# EAGLE design Wii Board (EAGLE 6.6.0)
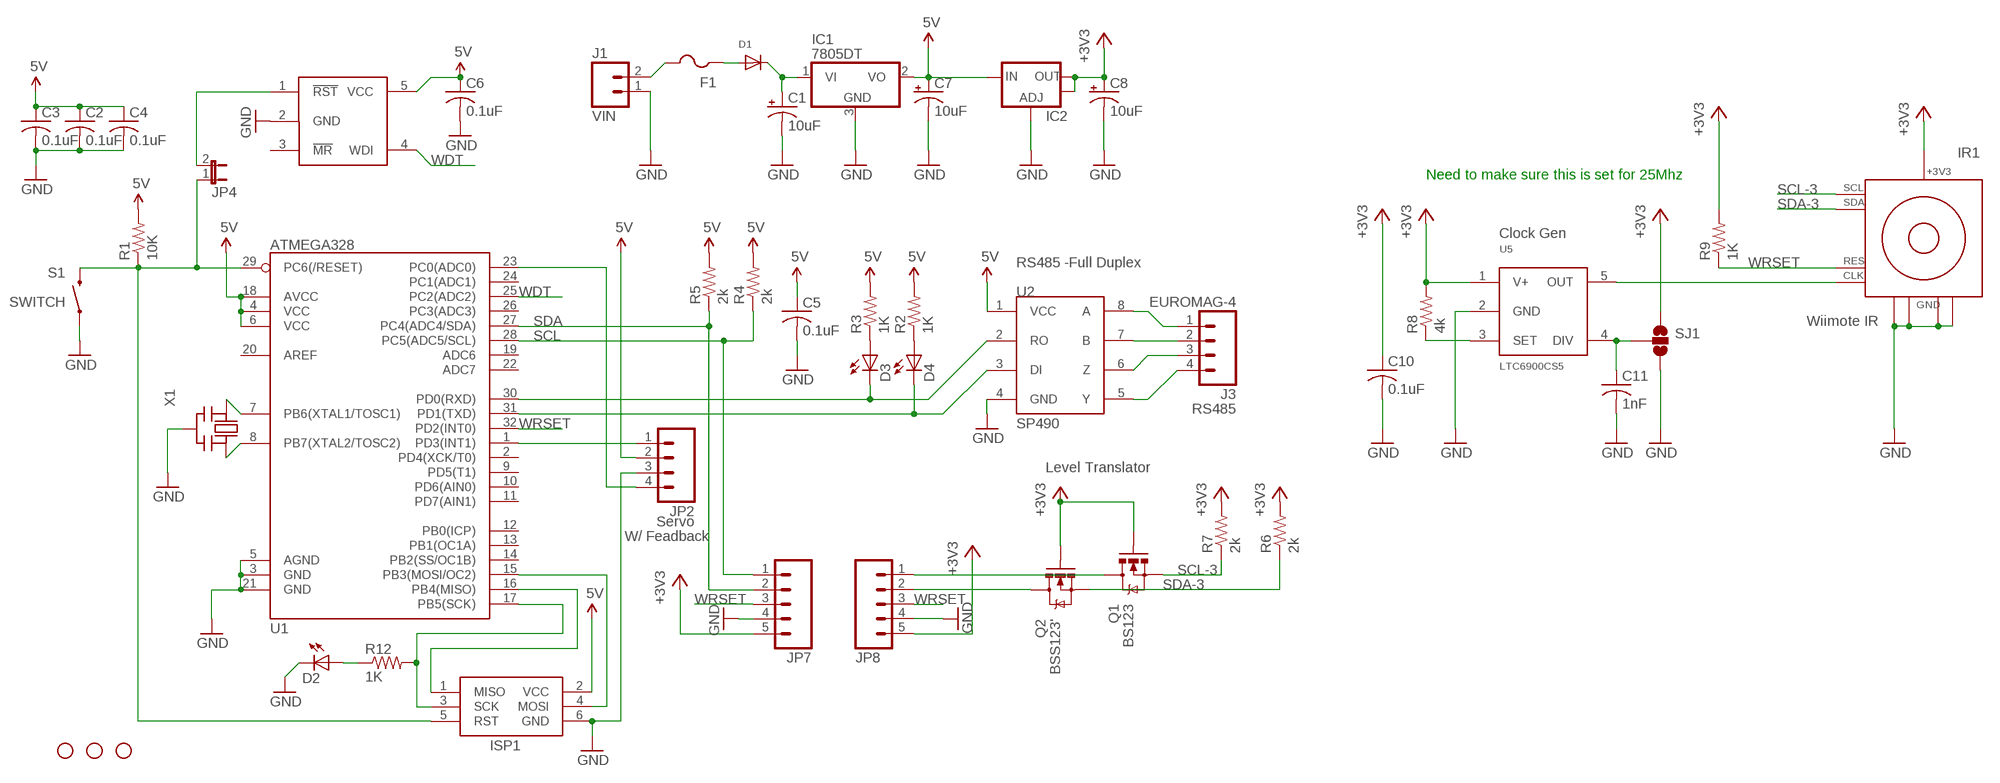
[diagram p0: schematic, sheet 1]

## Parts
C1  10uF  CPOL-USCT6032  [CT6032]
C2  0.1uF  C-USC0805  [C0805]
C3  0.1uF  C-USC0805  [C0805]
C4  0.1uF  C-USC0805  [C0805]
C5  0.1uF  C-USC0805  [C0805]
C6  0.1uF  C-USC0805  [C0805]
C7  10uF  CPOL-USCT3216  [CT3216]
C8  10uF  CPOL-USCT3528  [CT3528]
C10  0.1uF  C-USC0805  [C0805]
C11  1nF  C-USC0805  [C0805]
D1  DIODESMA  [SMADIODE]
D2  LEDCHIPLED_0805  [CHIPLED_0805]
D3  LEDCHIPLED_0805  [CHIPLED_0805]
D4  LEDCHIPLED_0805  [CHIPLED_0805]
F1  PTCFUSE-1206  [R1206]
IC1  7805DT  [TO252]
IC2  V_REG_LM1117SOT223  [SOT223]
IR1  Wiimote IR  WII_IR_SENSOR  [WII_IR_SENSOR]
ISP1  AVRISP-6  [AVRISP]
J1  VIN  EUROMAG-290DEG  [M2]
J3  EUROMAG-4  [M4]
JP1  STAND-OFF  [STAND-OFF]
JP2  M04LOCK  [1X04_LOCK]
JP3  STAND-OFF  [STAND-OFF]
JP4  JUMPER-2SMD-NO  [SJ_2S-NO]
JP5  STAND-OFF  [STAND-OFF]
JP7  M05LOCK_LONGPADS  [1X05_LOCK_LONGPADS]
JP8  M05LOCK_LONGPADS  [1X05_LOCK_LONGPADS]
Q1  BS123  MOSFET-NCHANNELBSS123LT1G  [SOT23]
Q2  BSS123'  MOSFET-NCHANNELBSS123LT1G  [SOT23]
R1  10K  R-US_M0805  [M0805]
R2  1K  R-US_M0805  [M0805]
R3  1K  R-US_M0805  [M0805]
R4  2k  R-US_M0805  [M0805]
R5  2k  R-US_M0805  [M0805]
R6  2k  R-US_M0805  [M0805]
R7  2k  R-US_M0805  [M0805]
R8  4k  R-US_M0805  [M0805]
R9  1K  R-US_M0805  [M0805]
R12  1K  R-US_M0805  [M0805]
S1  SWITCH  SWITCH-MOMENTARY-2PTH  [TACTILE-PTH]
SJ1  SOLDERJUMPER_2WAYS  [SJ_3]
U1  ATMEGA328  ATMEGA168  [TQFP32-08]
U2  SP490  ISL83077  [SO08]
U3  MAX823  [SOT23-5L]
U5  LTC6900CS5  [TSOT-23-5]
X1  CERMOSCILL-AWCSR  [AWCSR]

## Nets
5V: C2.1 C3.1 C4.1 C5.1 C6.1 C7.+ IC1.2(VO) IC2.3(IN) ISP1.2(VCC) JP2.2 R1.2 R2.2 R3.2 R4.2 R5.2 U1.4(VCC) U1.6(VCC) U1.18(AVCC) U2.1(VCC) U3.5(VCC)
+3V3: C8.+ C10.1 IC2.2(OUT) IC2.4(OUT) IR1.1_+3V3(+3V3) JP7.5 JP8.5 Q1.1(G) Q2.1(G) R6.2 R7.2 R8.2 R9.2 SJ1.1 U5.1(V+)
C5: ISP1.4(MOSI) U1.15(PB3(MOSI/OC2))
GND: C1.- C2.2 C3.2 C4.2 C5.2 C6.2 C7.- C8.- C10.2 C11.2 D2.C IC1.3(GND) IC2.1(ADJ) IR1.2_GND@1(GND) IR1.3_GND@2(GND) IR1.GND@3(GND) IR1.GND@4(GND) ISP1.6(GND) J1.1 JP2.3 JP7.4 JP8.4 S1.1 SJ1.3 U1.3(GND) U1.5(AGND) U1.21(GND) U2.4(GND) U3.2(GND) U5.2(GND) X1.2(GND)
N$1: D3.C U1.30(PD0(RXD)) U2.2(RO)
N$2: F1.2 J1.2
N$3: D4.C U1.31(PD1(TXD)) U2.3(DI)
N$4: ISP1.5(RST) JP4.1 R1.1 S1.3 U1.29(PC6(/RESET))
N$5: U1.8(PB7(XTAL2/TOSC2)) X1.3(OUT)
N$6: J3.1 U2.8(A)
N$7: ISP1.1(MISO) U1.16(PB4(MISO))
N$8: D1.A F1.1
N$9: U1.7(PB6(XTAL1/TOSC1)) X1.1(IN)
N$10: D2.A R12.1
N$11: J3.2 U2.7(B)
N$12: J3.3 U2.6(Z)
N$13: C1.+ D1.C IC1.1(VI)
N$14: D4.A R2.1
N$15: J3.4 U2.5(Y)
N$16: D3.A R3.1
N$17: R8.1 U5.3(SET)
N$18: JP2.1 U1.1(PD3(INT1))
N$19: C11.1 SJ1.2 U5.4(DIV)
N$20: IR1.7_CLK(CLK) U5.5(OUT)
N$21: JP4.2 U3.1(!RST)
N$22: JP2.4 U1.23(PC0(ADC0))
N$23: JP8.1 Q1.3(D)
N$24: JP8.2 Q2.3(D)
SCL: JP7.1 R4.1 U1.28(PC5(ADC5/SCL))
SCL-3: IR1.5_SCL(SCL) Q1.2(S) R7.1
SCLK: ISP1.3(SCK) R12.2 U1.17(PB5(SCK))
SDA: JP7.2 R5.1 U1.27(PC4(ADC4/SDA))
SDA-3: IR1.6_SDA(SDA) Q2.2(S) R6.1
WDT: U1.25(PC2(ADC2)) U3.4(WDI)
WRSET: IR1.8_RESET(RES) JP7.3 JP8.3 R9.1 U1.32(PD2(INT0))
Unconnected: U1.2(PD4(XCK/T0)) U1.9(PD5(T1)) U1.10(PD6(AIN0)) U1.11(PD7(AIN1)) U1.12(PB0(ICP)) U1.13(PB1(OC1A)) U1.14(PB2(SS/OC1B)) U1.19(ADC6) U1.20(AREF) U1.22(ADC7) U1.24(PC1(ADC1)) U1.26(PC3(ADC3)) U3.3(!MR)

## Notes on the sheet
- Need to make sure this is set for 25Mhz
- Clock Gen
- RS485 -Full Duplex
- RS485
- Level Translator
- Servo
- W/ Feadback

## Library data of the parts
C1 C7 C8 = adafruit:CPOL-US: POLARIZED CAPACITOR, American symbol
C2-C6 C10 C11 = adafruit:C-US: CAPACITOR, American symbol
D1 = adafruit:DIODE: Diode SMADIODE - SMA Surface Mount Package 20V 1A Schottky Diode Digikey: 641-1014-6-ND DO-1N4148 - Through Hole Small Current Diode SOD-123 20V 1 A (.5mV Vf) Schottky Diode - Digikey: MBRX120TPMSCT-ND SOD-323 10V 570mA (.38mV Vf, 3ns) Schottky Diode - Digikey: ZLLS410CT-ND SOD-523 30V 30mA Schottky Diode (RB751S-40TE61) - Digikey: RB751S-40TE61CT-ND SOT23-R/W - SOT23 Package (R = Solder Paste/Reflow Ovens, W = Hand-Soldering) BAT54Film 40V 300mA - Digikey: 497-7162-1-ND
D2-D4 = adafruit:LED: LED OSRAM: - CHIPLED LG R971, LG N971, LY N971, LG Q971, LY Q971, LO R971, LY R971 LH N974, LH R974 LS Q976, LO Q976, LY Q976 LO Q996 - Hyper CHIPLED LW Q18S LB Q993, LB Q99A, LB R99A - SideLED LS A670, LO A670, LY A670, LG A670, LP A670 LB A673, LV A673, LT A673, LW A673 LH A674 LY A675 LS A676, LA A676, LO A676, LY A676, LW A676 LS A679, LY A679, LG A679 - Hyper Micro SIDELED® LS Y876, LA Y876, LO Y876, LY Y876 LT Y87S - SmartLED LW L88C, LW L88S LB L89C, LB L89S, LG L890 LS L89K, LO L89K, LY L89K LS L896, LA L896, LO L896, LY L896 - TOPLED LS T670, LO T670, LY T670, LG T670, LP T670 LSG T670, LSP T670, LSY T670, LOP T670, LYG T670 LG T671, LOG T671, LSG T671 LB T673, LV T673, LT T673, LW T673 LH T674 LS T676, LA T676, LO T676, LY T676, LB T676, LH T676, LSB T676, LW T676 LB T67C, LV T67C, LT T67C, LS T67K, LO T67K, LY T67K, LW E67C LS E67B, LA E67B, LO E67B, LY E67B, LB E67C, LV E67C, LT E67C LW T67C LS T679, LY T679, LG T679 LS T770, LO T770, LY T770, LG T770, LP T770 LB T773, LV T773, LT T773, LW T773 LH T774 LS E675, LA E675, LY E675, LS T675 LS T776, LA T776, LO T776, LY T776, LB T776 LHGB T686 LT T68C, LB T68C - Hyper Mini TOPLED® LB M676 - Mini TOPLED Santana® LG M470 LS M47K, LO M47K, LY M47K Source: http://www.osram.convergy.de/
F1 = adafruit:PTCFUSE: PTC fuses, resettable thermistors
IC1 = adafruit:78*: Positive VOLTAGE REGULATOR Added bigger pads to the TO-92 package
IC2 = SparkFun-PowerIC:V_REG_LM1117: Voltage Regulator LM1117 Standard adjustable voltage regulator but in SMD form. Spark Fun Electronics SKU : COM-00595
IR1 = OWN:WII_IR_SENSOR
ISP1 = adafruit:AVRISP: AVR ISP HEADER Standard 6 pin header for AVR programming
J1 = NASA_LIB:EUROMAG-2
J3 = NASA_LIB:EUROMAG-4
JP1 JP3 JP5 = SparkFun:STAND-OFF: Stand Off This is the mechanical footprint for a #4 phillips button head screw. Use the keepout ring to avoid running the screw head into surrounding components. SKU : PRT-00447
JP2 = SparkFun-Connectors:M04: Header 4 Standard 4-pin 0.1" header. Use with straight break away headers (SKU : PRT-00116), right angle break away headers (PRT-00553), swiss pins (PRT-00743), machine pins (PRT-00117), and female headers (PRT-00115). Molex polarized connector foot print use with SKU : PRT-08231 with associated crimp pins and housings. 1MM SMD Version SKU: PRT-10208
JP4 = SparkFun-Passives:JUMPER-2: Jumper Basic 0.1" spaced jumper. Use with breakaway headers.
JP7 JP8 = SparkFun-Connectors:M05: Header 5 Standard 5-pin 0.1" header. Use with straight break away headers (SKU : PRT-00116), right angle break away headers (PRT-00553), swiss pins (PRT-00743), machine pins (PRT-00117), and female headers (PRT-00115). Molex polarized connector foot print use with SKU : PRT-08230 with associated crimp pins and housings.
Q1 Q2 = SparkFun-DiscreteSemi:MOSFET-NCHANNEL: Common NMOSFET Parts MFG P/N Store ID Prod ID FDD8780 TRANS-09984 SI7820DN TRANS-11055 FDS6630A IC-08089 2N7002PW TRANS-11151 FQP30N06L COM-10213 TRANS-10060 BSS123LT1G TRANS-08345 BSS138 TRANS-00830 BS170 2N7000; PROD_ID: TRANS-08345
R1-R9 R12 = adafruit:R-US_: RESISTOR, American symbol
S1 = SparkFun:SWITCH-MOMENTARY-2
SJ1 = SparkFun-Passives:SOLDERJUMPER_2WAY: Solder Jumper 2 way solder jumper
U1 = SparkFun:ATMEGA168
U2 = NASA_LIB:ISL83077
U3 = NASA_LIB:MAX823
U5 = Gilson:LTC6900CS5
X1 = adafruit:CERMOSCILL: Ceramic oscillator with built in capacitors such as ZTT-12MHz http://www.ladyada.net/library/eagle

## Net classes
0 default: width 0.4 mm, drill 0.6 mm, clearance 0.3 mm
1 power: width 0.6 mm, drill 0.6 mm, clearance 0.3 mm

## Board
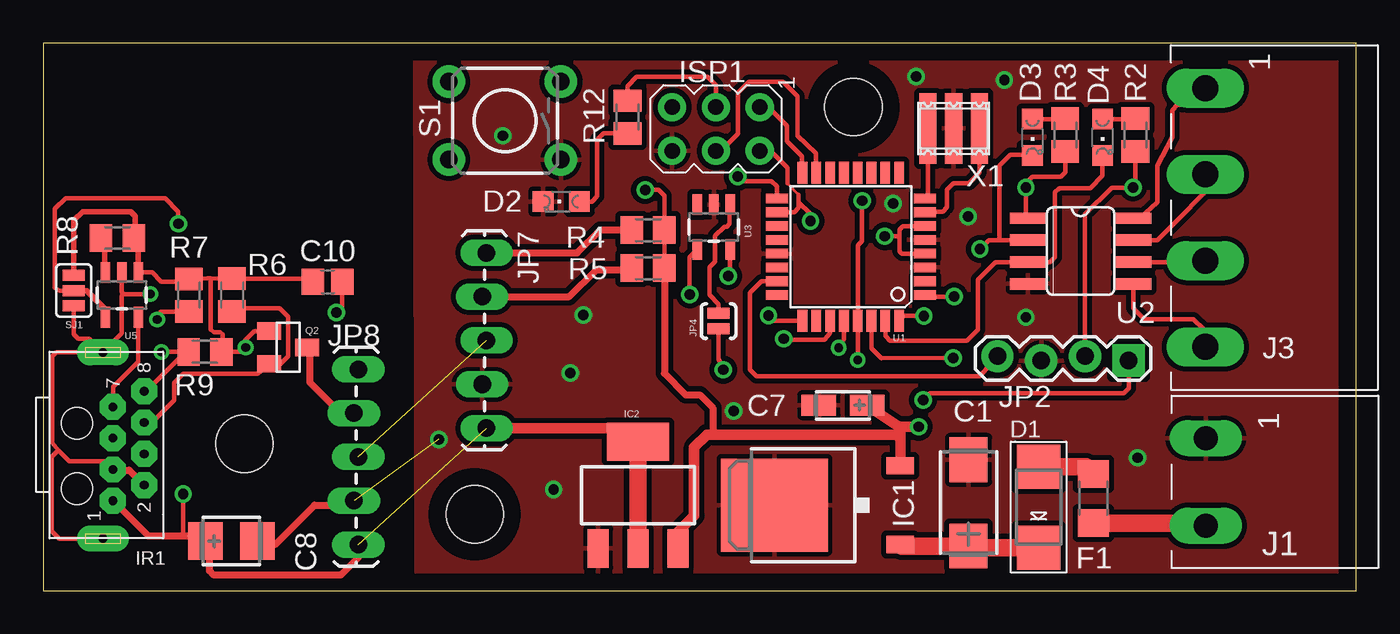
[diagram p1: board, top side]
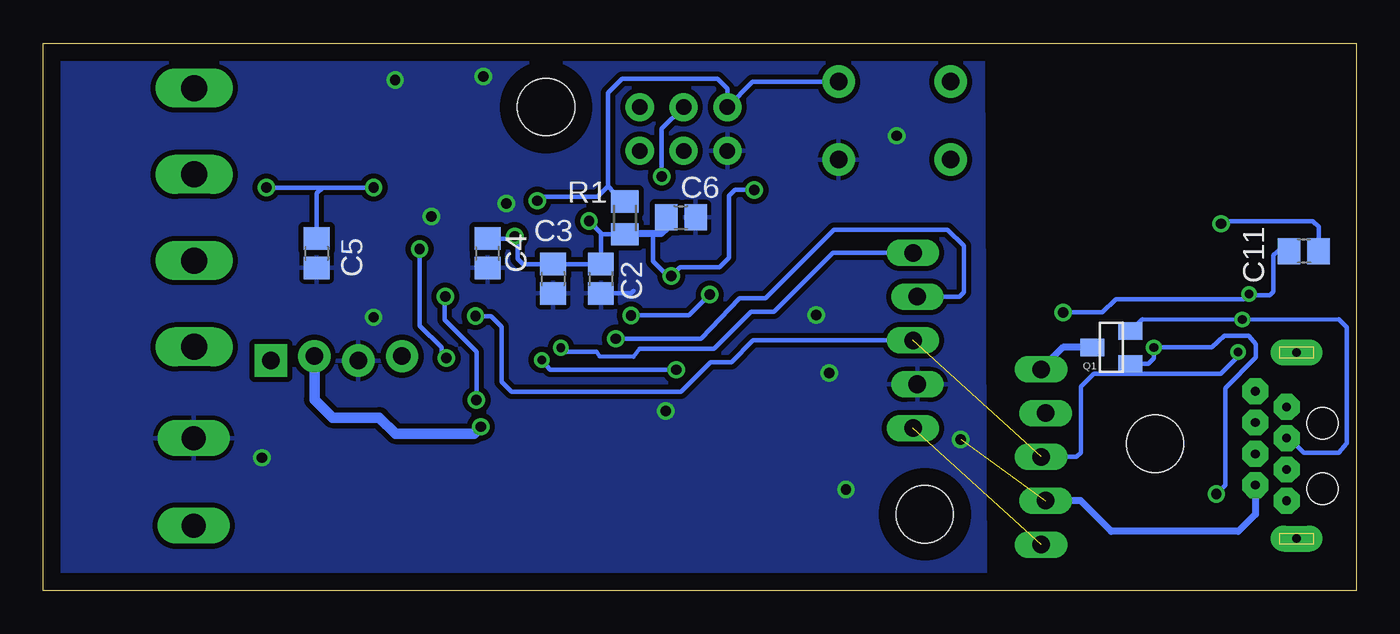
[diagram p2: board, bottom side, seen from below]

Size 76.2 x 31.75 mm. Coordinates in mm from the lower left corner, seen from the top.
Outline: 0,0 76.2,0 76.2,31.75 0,31.75 0,0
Copper layers (1*16): Top 0.035mm / dielectric 1.5mm / Bottom 0.035mm
Design rules "default *": minimum track width 7mil, minimum drill 24mil, track to track 8mil, track to pad 8mil, pad to pad 8mil, via to via 8mil, smd to smd 8mil, copper to edge 40mil, drill to drill 8mil, minimum pad ring 10mil, minimum via ring 8mil, stop-mask expansion 4mil, vias tented up to drill 0mil, thermal gap 10mil

### Footprints (pad centres in the part's own frame; a part is rotated, then mirrored left to right if it is on the bottom)
CT6032 = smd 2.6 x 2.2: + 2.5,0; - -2.5,0
C0805 = smd 1.3 x 1.5: 1 -0.85,0; 2 0.85,0
CT3216 = smd 2 x 1.2: + 1.4,0; - -1.4,0
CT3528 = smd 2 x 2.2: + 1.5,0; - -1.5,0
SMADIODE = smd 2.54 x 2.54: A 2.349,0; C -2.349,0
CHIPLED_0805 = smd 1.2 x 1.2: A 0,-1.05; C 0,1.05
R1206 = smd 1.6 x 1.803: 1 -1.422,0; 2 1.422,0
TO252 = smd 1 x 1.6: 1 -2.28,-4.8; 2 2.28,-4.8 | smd 5.4 x 6.2: 3 0,2.5
SOT223 = smd 1.219 x 2.235: 1 -2.311,-3.099; 2 0,-3.099; 3 2.311,-3.099 | smd 3.6 x 2.2: 4 0,3.099
WII_IR_SENSOR = drill 0.5 pad 1.5 octagon: 1_+3V3 0,0.014; 2_GND@1 0.907,-1.8; 3_GND@2 1.814,0.014; 4_NC 2.721,-1.8; 5_SCL 3.629,0.014; 6_SDA 4.536,-1.8; 7_CLK 5.443,0.014; 8_RESET 6.35,-1.8 | drill 0.5 pad 1.5 long: GND@3 -2.2,0.6; GND@4 8.6,0.6 | hole 1.8: 4.5,2.1; 0.7,2.1
AVRISP = drill 0.9 pad 1.626: 1 -1.27,2.54; 2 1.27,2.54; 3 -1.27,0; 4 1.27,0; 5 -1.27,-2.54; 6 1.27,-2.54
M2 = drill 1.4 long: 1 -2.54,0; 2 2.54,0
M4 = drill 1.5 long: 1 0,0; 2 5,0; 3 10,0; 4 15,0
STAND-OFF = hole 3.302: 0,0
1X04_LOCK = drill 1.016 pad 1.88 square: 1 0,0.127 | drill 1.016 pad 1.88: 2 2.54,-0.127; 3 5.08,0.127; 4 7.62,-0.127
SJ_2S-NO = smd 0.635 x 1.27: 1 -0.45,0; 2 0.45,0
1X05_LOCK_LONGPADS = drill 1.016 long: 1 0,0; 2 2.54,-0.254; 3 5.08,0; 4 7.62,-0.254; 5 10.16,0
SOT23 = smd 1 x 1.4: 1 -0.95,-1.1; 2 0.95,-1.1; 3 0,1.1
M0805 = smd 1.3 x 1.6: 1 -0.95,0; 2 0.95,0
TACTILE-PTH = drill 1.016 pad 1.88: 1 -3.251,2.261; 2 3.251,2.261; 3 -3.251,-2.261; 4 3.251,-2.261
SJ_3 = smd 0.635 x 1.27: 1 -0.889,0; 2 0,0; 3 0.889,0
TQFP32-08 = smd 1.27 x 0.559: 1 -4.293,2.8; 2 -4.293,2; 3 -4.293,1.2; 4 -4.293,0.4; 5 -4.293,-0.4; 6 -4.293,-1.2; 7 -4.293,-2; 8 -4.293,-2.8; 17 4.293,-2.8; 18 4.293,-2; 19 4.293,-1.2; 20 4.293,-0.4; 21 4.293,0.4; 22 4.293,1.2; 23 4.293,2; 24 4.293,2.8 | smd 0.559 x 1.27: 9 -2.8,-4.293; 10 -2,-4.293; 11 -1.2,-4.293; 12 -0.4,-4.293; 13 0.4,-4.293; 14 1.2,-4.293; 15 2,-4.293; 16 2.8,-4.293; 25 2.8,4.293; 26 2,4.293; 27 1.2,4.293; 28 0.4,4.293; 29 -0.4,4.293; 30 -1.2,4.293; 31 -2,4.293; 32 -2.8,4.293
SO08 = smd 0.66 x 2.032: 1 -1.905,-3.073; 2 -0.635,-3.073; 3 0.635,-3.073; 4 1.905,-3.073; 5 1.905,3.073; 6 0.635,3.073; 7 -0.635,3.073; 8 -1.905,3.073
SOT23-5L = smd 0.55 x 1.2: 1 -0.95,-1.3; 2 0,-1.3; 3 0.95,-1.3; 4 0.95,1.3; 5 -0.95,1.3
TSOT-23-5 = smd 0.55 x 1.2: 1 -0.95,-1.3; 2 0,-1.3; 3 0.95,-1.3; 4 0.95,1.3; 5 -0.95,1.3
AWCSR = smd 1 x 4.1: 1 -1.5,0; 2 0,0; 3 1.5,0

### Placement (x,y rotation side)
C1  53.7,5.08 270 top
C2  43.84,18.08 270 bottom
C3  46.61,18.08 270 bottom
C4  50.42,19.56 270 bottom
C5  60.33,19.56 270 bottom
C6  39.19,21.64 0 bottom
C7  46.41,10.74 0 top
C8  10.92,2.87 180 top
C10  16.51,17.91 0 top
C11  3.05,19.68 180 bottom
D1  57.76,4.83 90 top
D2  30.06,22.56 90 top
D3  57.4,26.29 180 top
D4  61.47,26.29 180 top
F1  60.93,5.33 270 top
IC1  44.93,4.95 90 top
IC2  34.52,5.54 0 top
IR1  4.06,5.21 90 top
ISP1  39.04,26.77 270 top
J1  67.46,6.3 270 top
J3  67.44,29.13 270 top
JP1  11.68,8.51 0 top
JP2  62.99,13.46 180 top
JP3  47.02,28.04 0 top
JP4  39.19,15.62 90 top
JP5  25.04,4.42 0 top
JP7  25.73,19.58 270 top
JP8  18.29,12.83 270 top
Q1  14.22,14.1 90 bottom
Q2  14.22,14.1 270 top
R1  42.44,21.62 270 bottom
R2  63.37,26.42 270 top
R3  59.31,26.42 270 top
R4  35.1,20.9 0 top
R5  35.1,18.69 0 top
R6  10.97,17.14 90 top
R7  8.46,17.13 90 top
R8  4.32,20.45 0 top
R9  9.4,13.84 0 top
R12  33.91,27.46 90 top
S1  26.8,27.25 180 top
SJ1  1.78,17.4 270 top
U1  46.86,19.94 180 top
U2  60.2,19.68 270 top
U3  38.91,21.08 180 top
U5  4.57,17.14 180 top
X1  52.83,26.8 180 top

### Tracks (layer width: path | path; a pad name or v marks a point on that pad's centre or on a via)
5V  (via drill 0.6)
  Top 0.178: 43.18,23.62 43.84,22.96
  Top 0.254: R3.2 59.31,24.26 59.05,24 57.4,24 57.02,23.62 v57.02,23.37 57.02,21.69 U2.1 | R2.2 63.37,23.5 v63.25,23.37 62,23.37 60.45,21.82 JP2.2 | U1.6 49.89,21.14 49.68,20.93 49.68,20.6 | 49.68,20.6 49.68,19.68 49.84,19.53 U1.4 | v48.84,20.55 49.63,20.55 49.68,20.6 | ISP1.2 42.19,25.5 43.18,24.51 43.18,23.62 | 43.84,22.96 43.84,22.53 | 43.84,22.53 43.84,22.2 43.59,21.95 U1.18 | v44.53,21.44 44.53,21.84 43.84,22.53 | U3.5 39.86,18.35 v39.75,18.24 | R4.2 R5.2 36.05,22.89 35.7,23.24 v34.93,23.24
  Top 0.406: R5.2 36.05,12.59 37.29,11.35 38.1,11.35 38.86,10.59 38.86,9.14 38.76,9.04
  Top 0.61: IC1.2 49.73,8.79 | 49.73,8.79 49.73,9.43 49.66,9.5 | 49.66,9.5 C7.+ | v50.8,9.5 49.66,9.5 | IC2.3 36.83,3.4 37.77,4.34 37.77,8.31 38.51,9.04 38.76,9.04 49.48,9.04 49.73,8.79
  Bottom 0.254: v63.25,23.37 59.99,23.37 | 59.99,23.37 v57.02,23.37 | C5.1 60.33,23.04 59.99,23.37 | C4.1 49.06,20.41 v48.84,20.55 48.66,20.27 48.66,19.23 48.35,18.93 C3.1 C2.1 43.84,20.6 43.78,20.66 | R1.2 43.78,20.66 | 43.78,20.66 v44.53,21.44 | 40.84,20.7 40.82,20.68 40.82,19.1 39.95,18.24 v39.75,18.24 39.23,18.75 36.95,18.75 36.4,19.3 36.4,22.89 36.06,23.24 v34.93,23.24
  Bottom 0.406: C6.1 40.04,20.99 40.34,20.7 40.84,20.7 42.41,20.7 R1.2
  Bottom 0.61: JP2.2 60.45,11.07 59.41,10.03 56.69,10.03 55.75,9.09 51.21,9.09 v50.8,9.5
+3V3  (via drill 0.5, 0.6)  (1 unrouted)
  Top 0.254: U5.1 6.32,18.45 6.86,17.91 8.06,17.91 R7.2 9.54,18.11 | C10.1 15.34,18.09 R6.2 9.54,18.11 | 9.54,18.11 9.73,18.11 9.74,15.14 9.93,14.99 10.29,14.99 10.41,14.86 10.41,13.91 R9.2 11.56,13.84 v11.75,14.1 11.74,14.52 12.25,15.04 Q2.1 | v8.13,5.59 8.13,3.3 8,3.17
  Top 0.305: SJ1.1 1.78,21.46 2.29,21.97 5.08,21.97 5.33,21.72 5.33,20.51 R8.2 5.52,20.19 U5.1
  Top 0.406: IR1.1_+3V3 4.06,5.21 6.1,3.17 8,3.17 8.91,3.17 C8.+ 9.65,2.44 9.65,1.14 9.91,0.89 17.27,0.89 18.29,1.91 JP8.5
  Top 0.61: JP7.5 33.07,9.42 34.52,7.98
  Top 1.016: IC2.2 34.52,7.98 IC2.4
  Bottom 0.254: v8.13,5.59 7.62,6.1 7.62,11.74 5.83,13.52 5.84,14.27 6.24,14.78 7.67,14.79 8.38,14.1 v11.75,14.1 11.75,13.48 12.06,13.16 Q1.1
C5
  Top 0.254: ISP1.4 39.34,25.5 40.31,26.49 40.31,28.88 40.97,29.52 42.93,29.52 43.76,28.68 43.76,26.39 44.83,25.35 44.83,24.26 U1.15
GND  (via drill 0.5, 0.6)  (1 unrouted)
  Top 0.254: IR1.GND@4 0.75,13.81 0.53,13.59 0.53,8.56 0.89,8.13 | 0.89,8.13 1.52,7.49 3.58,7.49 IR1.3_GND@2 | IR1.GND@3 0.93,3.01 0.51,3.43 0.51,7.75 0.89,8.13 | SJ1.3 1.78,14.86 2.03,14.61 2.67,14.61 IR1.GND@4 | IR1.GND@4 4.57,14.91 4.57,17.1 4.67,17.19 | C10.2 17.36,16.47 v17.02,16.13 | v6.22,17.19 4.67,17.19 | 4.67,17.19 4.57,17.3 U5.2
  Top 0.406: IR1.3_GND@2 4.54,7.02 4.57,6.99 4.99,6.99 IR1.2_GND@1 | C8.- 13.46,2.67 15.75,4.95 17.78,4.95 JP8.4
  Bottom 0.254: C11.2 4.57,19.68 4.83,19.43 4.83,17.34 5.03,17.14 6.17,17.14 v6.22,17.19 6.53,16.89 13.97,16.89 14.73,16.13 v17.02,16.13 | C2.2 42.07,17.23 41.94,17.37
  Bottom 0.406: IR1.2_GND@1 5.86,4.42 6.86,3.43 14.22,3.43 16,5.21 JP8.4
  other vias: 53.67,21.69 57.02,15.85 50.65,29.82 55.78,29.62 63.5,7.7 30.58,12.62 31.34,15.98 26.68,26.38 29.62,5.87 22.96,8.76 49.33,22.45 40.08,10.4
  pour Top: 21.58,31.59 21.68,0.14 76.2,0 76.2,31.75
  pour Bottom: 21.67,31.65 21.56,0.13 76.2,0 76.2,31.75
N$1  (via drill 0.6)
  Top 0.254: U2.2 55.5,20.32 | 55.5,20.32 55.5,24.64 56.13,25.27 57.37,25.27 D3.C | 55.5,20.32 54.86,20.32 v54.36,19.81 | v52.79,13.49 48.64,13.48 48.07,14.06 48.07,15.53 U1.30
  Bottom 0.254: v54.36,19.81 54.36,15.37 53.09,14.1 53.09,13.72 v52.79,13.49
N$2
  Top 1.016: F1.2 67.31,3.91 J1.2
N$3
  Top 0.254: U1.31 48.86,14.76 49.15,14.48 53.59,14.48 54.23,15.11 54.23,18.03 55.24,19.05 U2.3 57.15,19.07 57.63,19.07 57.66,19.05 58.42,19.05 58.7,19.33 58.7,23.09 58.95,23.34 60.76,23.34 61.47,24.05 D4.C
N$4  (via drill 0.5, 0.6)
  Top 0.254: v47.52,22.61 47.52,20.27 47.27,20.02 U1.29 47.27,15.54 v47.27,13.38 | JP4.1 39.19,13.44 v39.47,12.8
  Bottom 0.254: 43.43,23.44 43.43,28.88 42.62,29.69 37.08,29.69 36.5,29.11 ISP1.5 35.03,29.52 S1.3 | 43.43,23.44 44.04,22.84 47.3,22.84 v47.52,22.61 | R1.1 43.06,23.07 43.43,23.44 | v39.47,12.8 46.79,12.8 v47.27,13.38
N$5
  Top 0.254: X1.3 51.33,22.91 U1.8
N$6
  Top 0.254: U2.8 63.63,21.59 64.64,22.53 64.64,24.64 65.51,26.29 65.51,27.86 65.81,28.17 67.33,28.17 J3.1
N$7
  Top 0.254: ISP1.1 42.09,28.04 43.16,26.95 43.16,26.06 44.04,25.2 44.04,24.25 U1.16
N$8
  Top 1.016: D1.A 60.52,7.18 F1.1
N$9
  Top 0.254: X1.1 54.33,24.23 53.72,23.62 52.83,23.62 52.45,23.24 52.45,22.23 52.2,21.97 51.19,21.97 U1.7
N$10
  Top 0.254: R12.1 32.51,26.51 32.15,26.14 32.15,22.86 31.84,22.56 D2.A
N$11
  Top 0.254: U2.7 64.64,20.32 65.71,21.39 67.46,23.14 J3.2
N$12
  Top 0.254: U2.6 66.45,19.05 J3.3
N$13
  Top 1.016: D1.C 53.8,2.48 C1.+ 49.83,2.58 IC1.1
N$14
  Top 0.254: D4.A 63.35,27.34 R2.1
N$15
  Top 0.254: U2.5 63.27,16.38 63.91,15.75 66.75,15.75 67.33,15.16 67.33,13.17 J3.4
N$16
  Top 0.254: D3.A 59.28,27.34 R3.1
N$17
  Top 0.305: U5.3 3.56,18.49 3.58,18.88 3.58,20.34 R8.1
N$18  (via drill 0.6)
  Top 0.254: JP2.1 62.99,11.73 62.71,11.46 51.46,11.46 v51.05,11.05 | v52.86,17.04 51.25,17.04 U1.1
  Bottom 0.254: v51.05,11.05 51.05,13.84 52.91,15.7 52.91,16.99 v52.86,17.04
N$19  (via drill 0.6)
  Top 0.254: v7.84,21.27 7.84,21.98 7.07,22.75 1.32,22.75 0.68,22.14 0.67,17.56 0.96,17.39 SJ1.2
  Top 0.305: SJ1.2 2.54,17.4 3.56,16.38 3.56,15.91 U5.4
  Bottom 0.254: C11.1 2.2,21.09 2.52,21.41 7.7,21.41 v7.84,21.27
N$20
  Top 0.254: U5.5 5.52,13.27 4.06,11.81 4.06,10.66 IR1.7_CLK
N$21
  Top 0.254: JP4.2 39.19,16.61 38.66,17.14 38.66,18.75 38.99,19.07 38.99,20.57 39.52,21.11 39.67,21.11 39.83,21.26 39.83,22.35 U3.1
N$22
  Top 0.254: U1.23 41.69,17.94 41.02,17.27 41.02,12.81 41.4,12.43 54.35,12.43 JP2.4
N$23
  Bottom 0.406: Q1.3 17.02,14.1 JP8.1
N$24
  Top 0.406: JP8.2 17.27,10.29 15.49,12.06 15.49,13.93 Q2.3
SCL  (via drill 0.5)
  Top 0.254: U1.28 46.46,14.59 v46.15,14.08
  Top 0.406: R4.1 32.31,20.9 30.99,19.58 JP7.1
  Bottom 0.254: v46.15,14.08 45.9,13.84 44.1,13.84 43.91,13.58 41.95,13.57 41.6,14.01 37.26,14.02 35.13,16.15 33.81,16.15 30.38,19.58 JP7.1
SCL-3  (via drill 0.5)
  Top 0.254: R7.1 6.81,16.18 v6.62,15.71
  Bottom 0.254: Q1.2 12.95,15.22 12.41,15.72 v6.62,15.71 1.02,15.73 0.56,15.27 0.56,8.53 1.02,8 3.05,8 3.88,8.84 IR1.5_SCL
SCLK  (via drill 0.6)
  Top 0.254: U1.17 42.57,23.44 42.27,23.75 40.64,23.75 v40.31,24 | R12.2 33.91,29.26 34.44,29.79 38.56,29.79 39.04,29.31 ISP1.3
  Bottom 0.254: v40.31,24 40.31,26.77 ISP1.3
SDA  (via drill 0.6)
  Top 0.254: U1.27 45.65,14.92 45.33,14.55 43.33,14.55 v42.98,14.61
  Top 0.406: JP7.2 30.53,17.04 32.11,18.62 34.08,18.62 R5.1
  Bottom 0.254: v42.98,14.61 38.02,14.61 35.79,16.94 34.29,16.94 30.3,20.93 23.72,20.93 22.78,19.99 22.78,17.3 23.04,17.04 JP7.2
SDA-3
  Top 0.254: R6.1 11.24,16.2 11.68,16.38 13.72,16.38 14.22,15.88 14.22,13.59 13.72,13.08 13.19,13.08 Q2.2 12.95,12.98 12.45,12.57 8.13,12.57 7.62,12.06 7.62,11.05 6.31,9.74 IR1.6_SDA
WDT  (via drill 0.6)
  Top 0.254: U1.25 42.39,15.65 v42.09,15.95 | v37.52,17.17 37.52,19.34 U3.4
  Bottom 0.254: v42.09,15.95 38.73,15.95 v37.52,17.17
WRSET  (via drill 0.5, 0.6)  (1 unrouted)
  Top 0.254: IR1.8_RESET 6.12,11.71 8.13,13.72 R9.1 v6.86,13.84 | v51.1,15.93 49.94,15.93 U1.32
  Bottom 0.254: v6.86,13.84 6.86,13.59 7.87,12.57 15.24,12.57 16,11.81 16,8 16.26,7.75 JP8.3 | JP7.3 35,14.5 36.27,13.23 37.49,13.23 39.19,11.53 49.02,11.53 49.61,12.12 49.61,15.29 50.22,15.9 51.08,15.9 v51.1,15.93